# EAGLE schematic Power-Conversion (EAGLE 7.3.0)
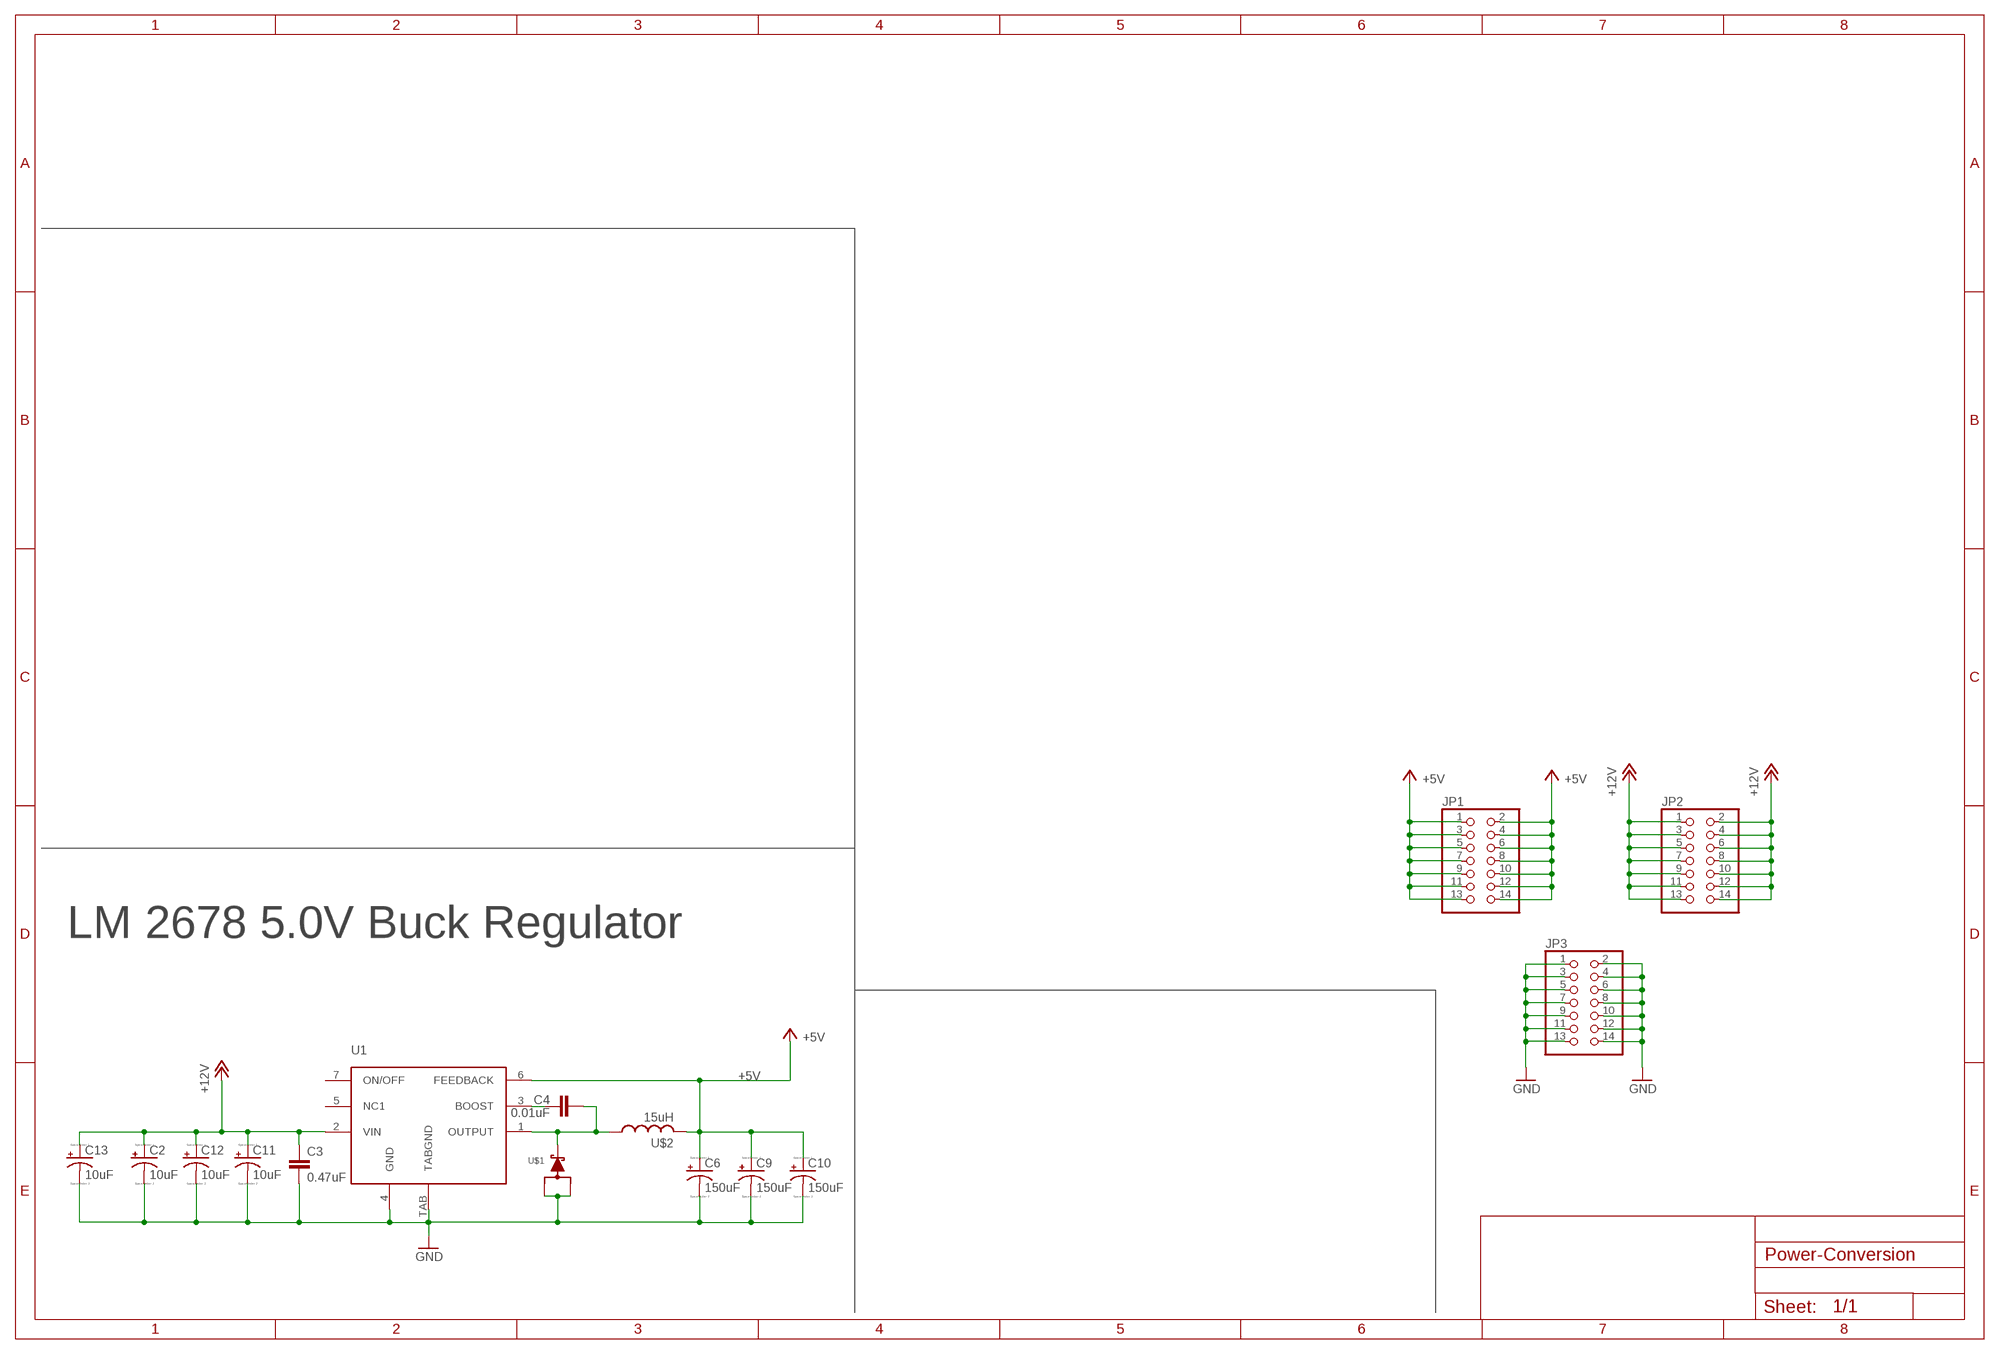
[diagram p0: schematic, sheet 1]

## Parts
C2  10uF  C-TANTALUM(10UF_150UF)  [CTAN(7.30_4.30MM)]
C3  0.47uF  CAP0805  [0805]
C4  0.01uF  CAP0603-CAP  [0603-CAP]
C6  150uF  C-TANTALUM(10UF_150UF)  [CTAN(7.30_4.30MM)]
C9  150uF  C-TANTALUM(10UF_150UF)  [CTAN(7.30_4.30MM)]
C10  150uF  C-TANTALUM(10UF_150UF)  [CTAN(7.30_4.30MM)]
C11  10uF  C-TANTALUM(10UF_150UF)  [CTAN(7.30_4.30MM)]
C12  10uF  C-TANTALUM(10UF_150UF)  [CTAN(7.30_4.30MM)]
C13  10uF  C-TANTALUM(10UF_150UF)  [CTAN(7.30_4.30MM)]
JP1  PINHD-2X7  [2X07]
JP2  PINHD-2X7  [2X07]
JP3  PINHD-2X7  [2X07]
U1  LM2678  [LM2678]
U$1  SWITCHMODE_SCHOTTKY  [DPAK-3]
U$2  15uH  HCMA1305  [HCMA1305]

## Nets
+5V: C6.+ C9.+ C10.+ JP1.1 JP1.2 JP1.3 JP1.4 JP1.5 JP1.6 JP1.7 JP1.8 JP1.9 JP1.10 JP1.11 JP1.12 JP1.13 JP1.14 U1.6(FEEDBACK) U$2.P$2
+12V: C2.+ C3.1 C11.+ C12.+ C13.+ JP2.1 JP2.2 JP2.3 JP2.4 JP2.5 JP2.6 JP2.7 JP2.8 JP2.9 JP2.10 JP2.11 JP2.12 JP2.13 JP2.14 U1.2(VIN)
GND: C2.- C3.2 C6.- C9.- C10.- C11.- C12.- C13.- JP3.1 JP3.2 JP3.3 JP3.4 JP3.5 JP3.6 JP3.7 JP3.8 JP3.9 JP3.10 JP3.11 JP3.12 JP3.13 JP3.14 U1.4(GND) U1.TAB(TABGND) U$1.P$1 U$1.P$3
N$2: C4.1 U1.3(BOOST)
N$3: C4.2 U1.1(OUTPUT) U$1.P$4 U$2.P$1
Unconnected: U1.5(NC1) U1.7(ON/OFF)

## Notes on the sheet
- LM 2678 5.0V Buck Regulator

## Library data of the parts
C2 C6 C9-C13 = PowerComponents:C-TANTALUM(10UF_150UF)
C3 = SparkFun-Capacitors:CAP: Capacitor Standard 0603 ceramic capacitor, and 0.1" leaded capacitor.
C4 = SparkFun-Passives:CAP: Capacitor Standard 0603 ceramic capacitor, and 0.1" leaded capacitor.
JP1-JP3 = pinhead:PINHD-2X7: PIN HEADER
U1 = PowerComponents:LM2678: LM2678 Buck Converter IC 12V-to-5V
U$1 = PowerComponents:SWITCHMODE_SCHOTTKY: {Digi-Key Part Number: MBRD835LT4GOSCT-ND} {Voltage - DC Reverse (Vr) (Max): 35V} {Current - Average Rectified (Io): 8A} {Voltage - Forward (Vf) (Max) @ If: 510mV @ 8A} {Speed: Fast Recovery =< 500ns, > 200mA (Io)} {Current - Reverse Leakage @ Vr: 1.4mA @ 35V} {Mounting Type: Surface Mount} {Package / Case: TO-252-3, DPak (2 Leads + Tab), SC-63} {Supplier Device Package: DPAK-3} {Operating Temperature - Junction: -65°C ~ 150°C}
U$2 = DiscreteComponents:HCMA1305